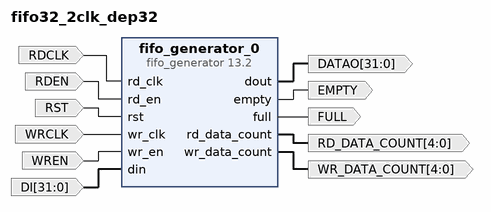
[diagram p0: block diagram of the top level]
# Vivado block design fifo32_2clk_dep32, xc7z045ffg900-2, Vivado 2018.3
create_bd_design fifo32_2clk_dep32

create_bd_port -dir I -type clk RDCLK
set_property -dict {CONFIG.FREQ_HZ 200000000} [get_bd_ports RDCLK]
create_bd_port -dir I RDEN
create_bd_port -dir I -type rst RST
set_property -dict {CONFIG.POLARITY ACTIVE_HIGH} [get_bd_ports RST]
create_bd_port -dir I -type clk WRCLK
set_property -dict {CONFIG.FREQ_HZ 200000000} [get_bd_ports WRCLK]
create_bd_port -dir I WREN
create_bd_port -dir O EMPTY
create_bd_port -dir O FULL
create_bd_port -dir I -from 31 -to 0 -type data DI
create_bd_port -dir O -from 31 -to 0 DATAO
create_bd_port -dir O -from 4 -to 0 -type data RD_DATA_COUNT
create_bd_port -dir O -from 4 -to 0 -type data WR_DATA_COUNT

create_bd_cell -type ip -vlnv xilinx.com:ip:fifo_generator:13.2 fifo_generator_0
set_property -dict [list \
  CONFIG.Enable_Reset_Synchronization true \
  CONFIG.Fifo_Implementation Independent_Clocks_Block_RAM \
  CONFIG.Full_Flags_Reset_Value 1 \
  CONFIG.Input_Data_Width 32 \
  CONFIG.Input_Depth 32 \
  CONFIG.Performance_Options First_Word_Fall_Through \
  CONFIG.Read_Data_Count true \
  CONFIG.Read_Data_Count_Width 5 \
  CONFIG.Use_Extra_Logic false \
  CONFIG.Write_Data_Count true \
  CONFIG.Write_Data_Count_Width 5 \
] [get_bd_cells fifo_generator_0]

# ---- connections ----

connect_bd_net [get_bd_ports RDCLK] [get_bd_pins fifo_generator_0/rd_clk]
connect_bd_net [get_bd_ports RDEN] [get_bd_pins fifo_generator_0/rd_en]
connect_bd_net [get_bd_ports RST] [get_bd_pins fifo_generator_0/rst]
connect_bd_net [get_bd_ports WRCLK] [get_bd_pins fifo_generator_0/wr_clk]
connect_bd_net [get_bd_ports WREN] [get_bd_pins fifo_generator_0/wr_en]
connect_bd_net [get_bd_pins fifo_generator_0/empty] [get_bd_ports EMPTY]
connect_bd_net [get_bd_pins fifo_generator_0/full] [get_bd_ports FULL]
connect_bd_net [get_bd_ports DI] [get_bd_pins fifo_generator_0/din]
connect_bd_net [get_bd_pins fifo_generator_0/dout] [get_bd_ports DATAO]
connect_bd_net [get_bd_pins fifo_generator_0/rd_data_count] [get_bd_ports RD_DATA_COUNT]
connect_bd_net [get_bd_pins fifo_generator_0/wr_data_count] [get_bd_ports WR_DATA_COUNT]

validate_bd_design
save_bd_design
